# Altium schematic sheet motorServoDriver.SchDoc
size A1; PageSetup: Record=PageOptions|CenterHorizontal=True|CenterVertical=True|PrintScale=1.00|XCorrection=1.00|YCorrection=1.00|PrintKind=1|BorderSize=5000000|LeftOffset=0|BottomOffset=0|Orientation=2|PaperLength=1000|PaperWidth=1000|Scale=100|PaperSource=7|PrintQuality=-3|MediaType=1|DitherType=10|PrintScaleMode=1|PaperKind=A3|PaperIndex=8
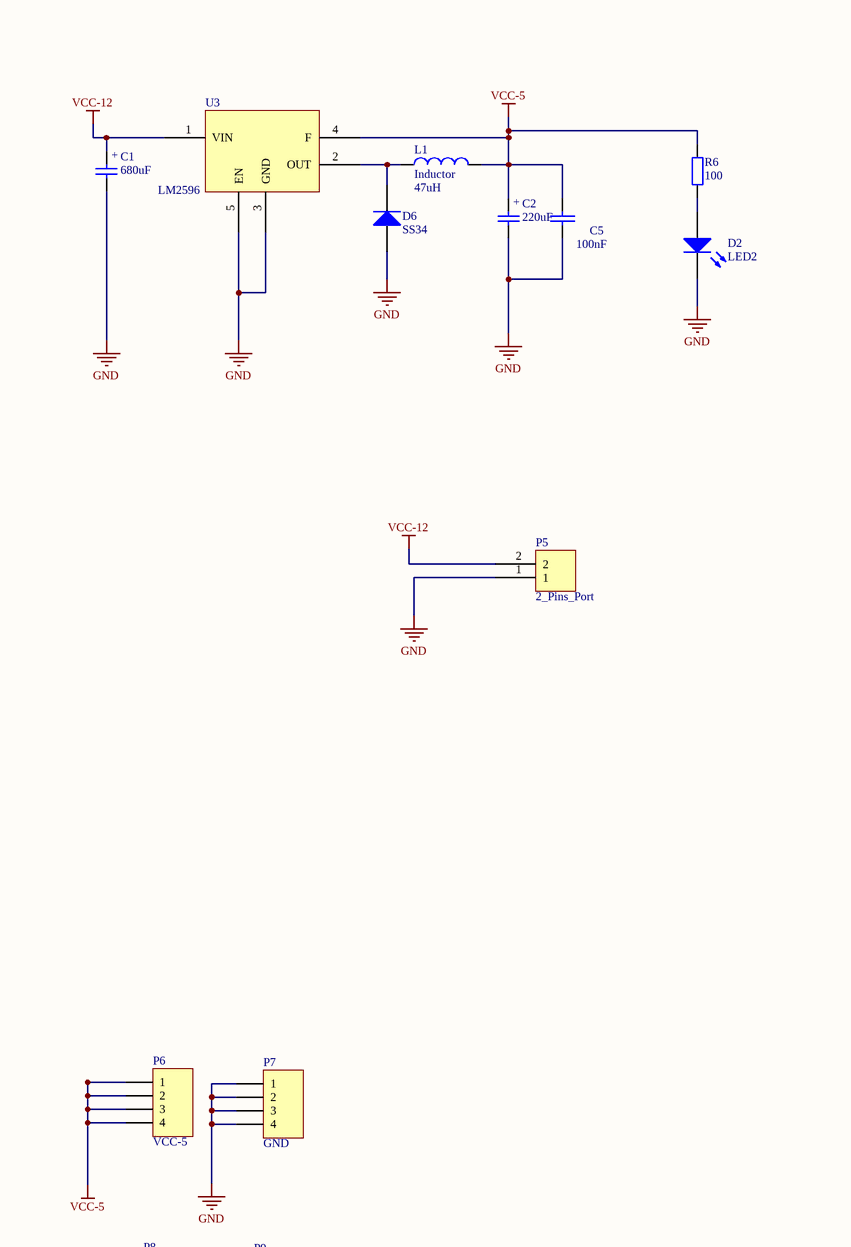
[diagram p0: motorServoDriver.SchDoc, top left]
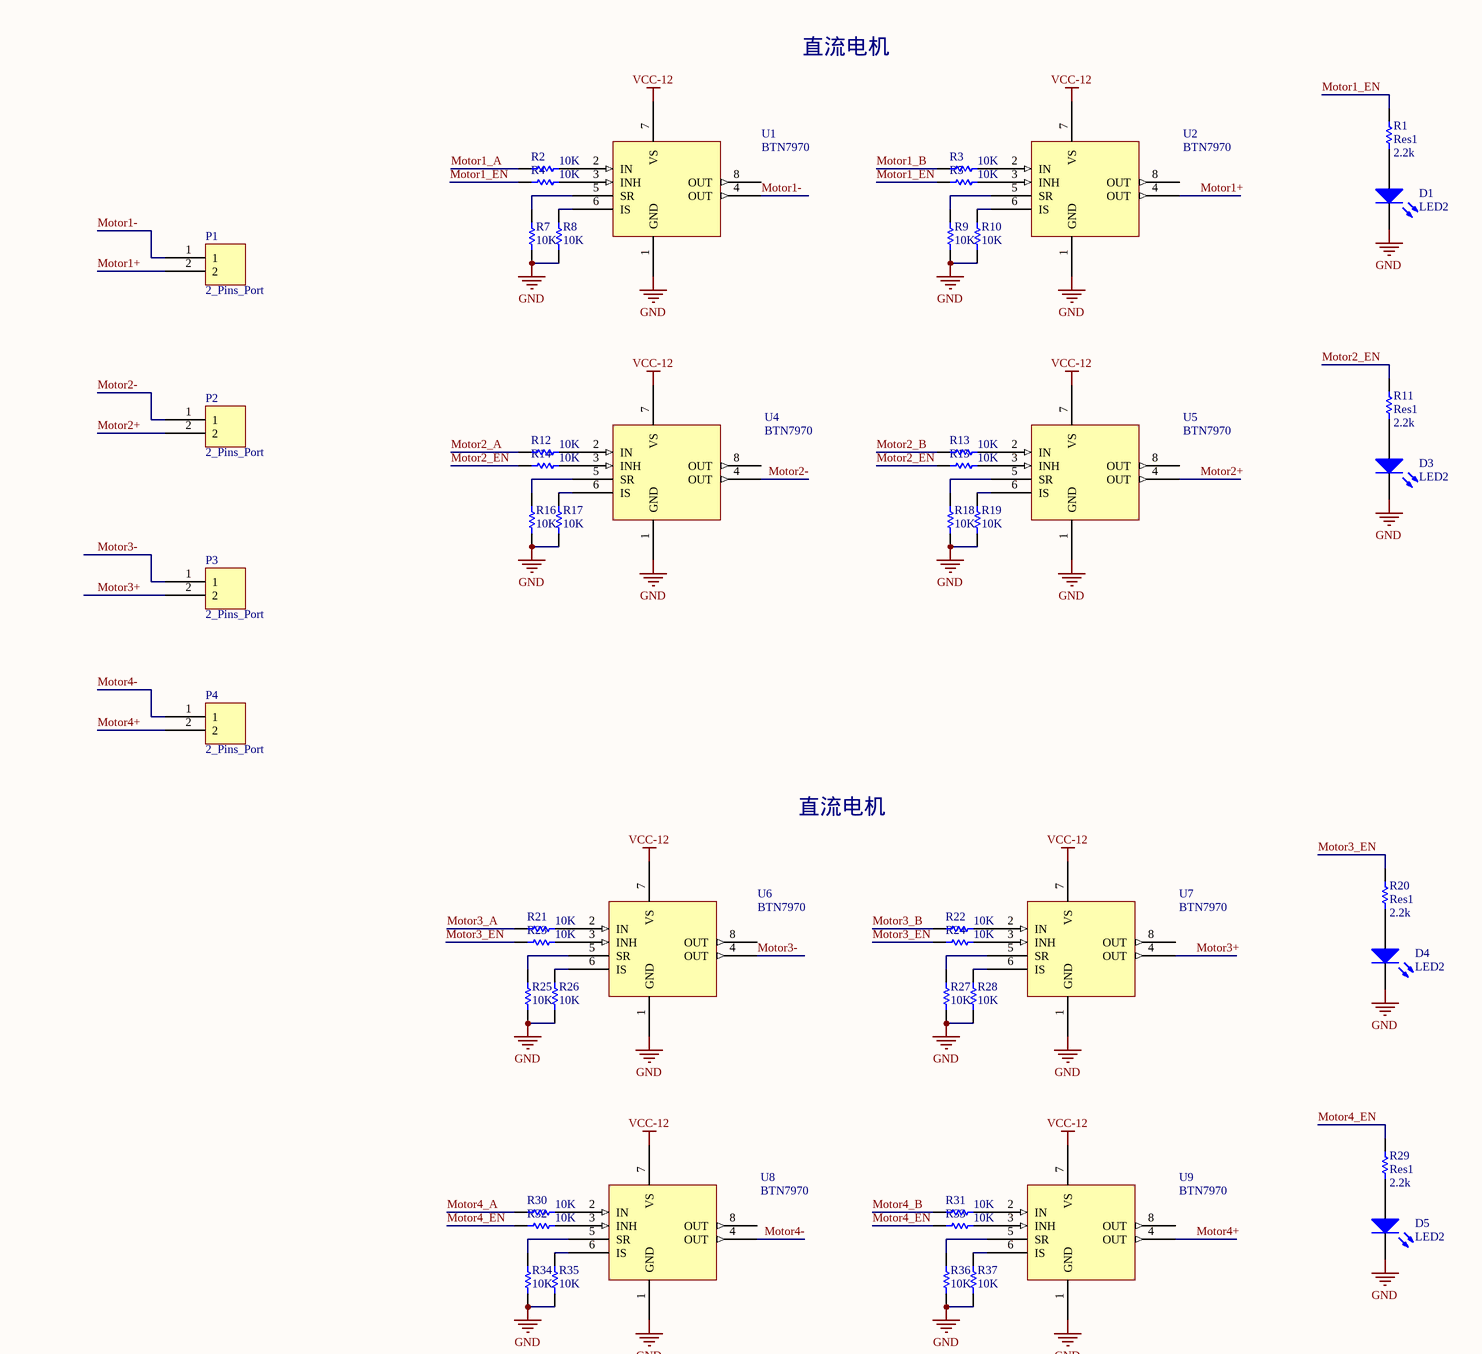
[diagram p1: motorServoDriver.SchDoc, top right]
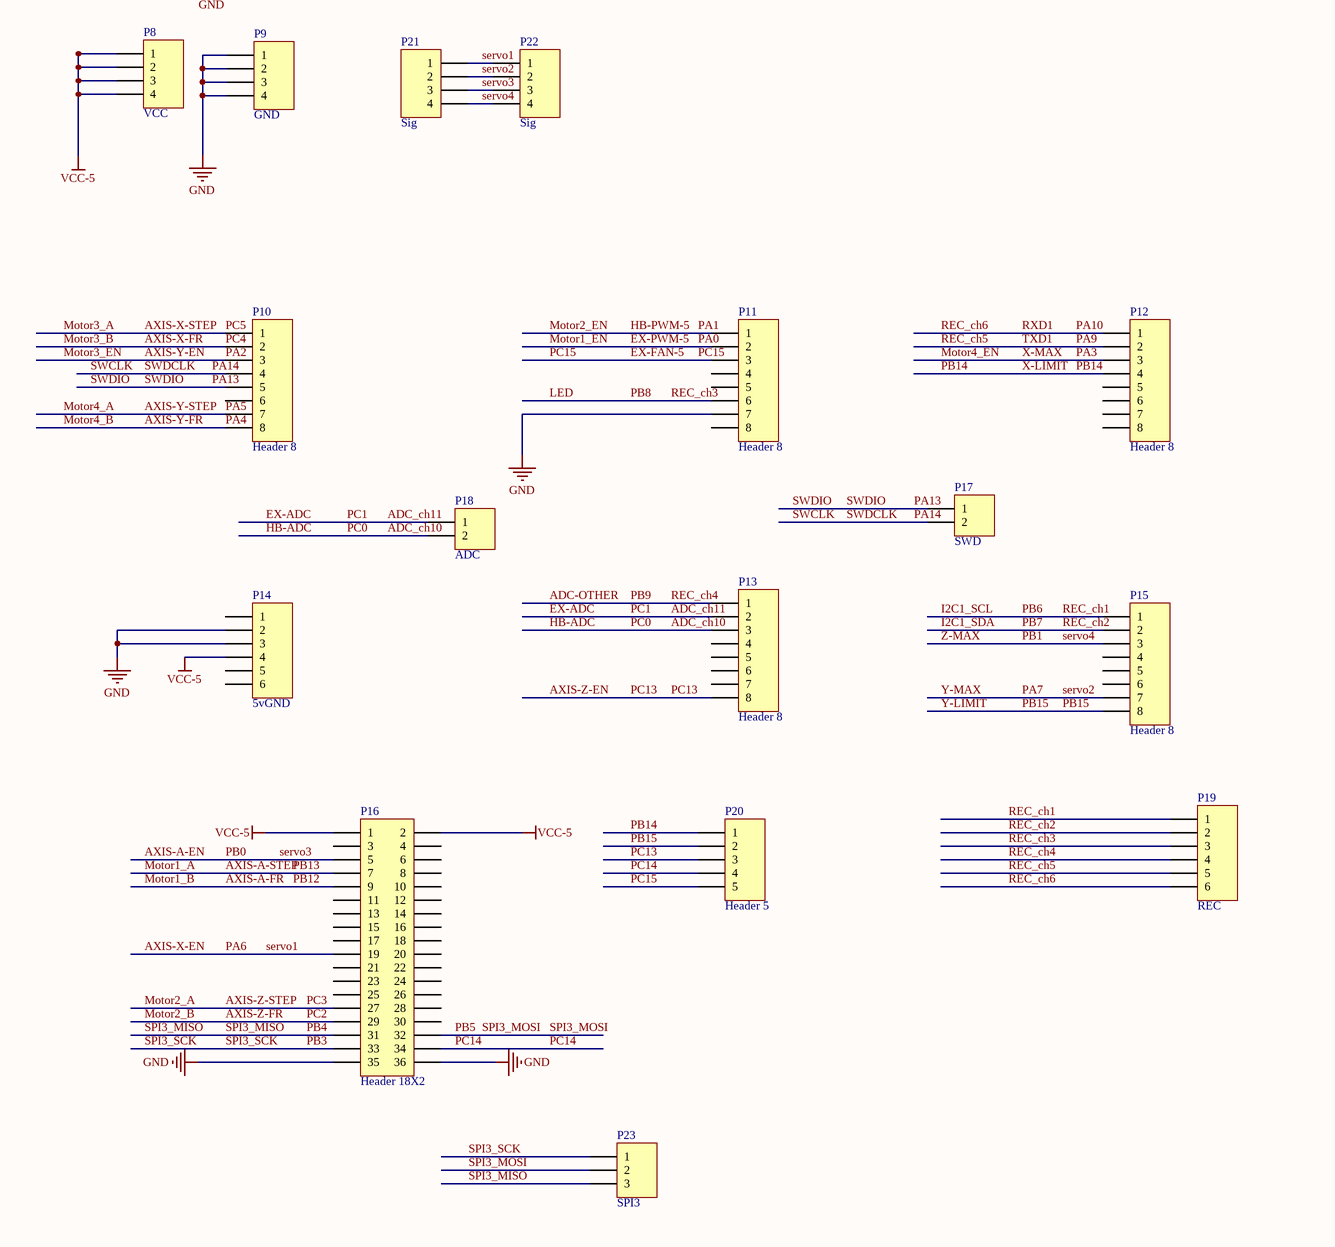
[diagram p2: motorServoDriver.SchDoc, bottom left]

## Parts
C1  value 680uF  [CAP-7343]  (hidden comment: Cap)
C2  value 220uF  [CAP-7343]  (hidden comment: Cap)
C5  value 100nF  [CAP-0603]  (hidden comment: cap smd)
D1  LED2  [D2012[0805]]
D2  LED2  [D2012[0805]]
D3  LED2  [D2012[0805]]
D4  LED2  [D2012[0805]]
D5  LED2  [D2012[0805]]
D6  SS34  [LC-SMB(DO-214AA)_S3]
L1  Inductor  value 47uH  [Inductor1207]
P1  2_Pins_Port  [WJ2EDGV-5.08-2P]
P2  2_Pins_Port  [WJ2EDGV-5.08-2P]
P3  2_Pins_Port  [WJ2EDGV-5.08-2P]
P4  2_Pins_Port  [WJ2EDGV-5.08-2P]
P5  2_Pins_Port  [WJ2EDGV-5.08-2P]
P6  VCC-5  [HDR1X4]
P7  GND  [HDR1X4]
P8  VCC  [HDR1X4]
P9  GND  [HDR1X4]
P10  Header 8  [HDR1X8]
P11  Header 8  [HDR1X8]
P12  Header 8  [HDR1X8]
P13  Header 8  [HDR1X8]
P14  5vGND  [HDR1x6]
P15  Header 8  [HDR1X8]
P16  Header 18X2  [HDR2X18]
P17  SWD  [HDR1X2]
P18  ADC  [HDR1X2]
P19  REC  [HDR1X6]
P20  Header 5  [HDR1X5]
P21  Sig  [HDR1X4]
P22  Sig  [HDR1X4]
P23  SPI3  [HDR1X3]
R1  Res1  value 2.2k  [RES-0603]
R2  10K  [RES-0603]
R3  10K  [RES-0603]
R4  10K  [RES-0603]
R5  10K  [RES-0603]
R6  value 100  [RES-0603]  (hidden comment: RES1)
R7  10K  [RES-0603]
R8  10K  [RES-0603]
R9  10K  [RES-0603]
R10  10K  [RES-0603]
R11  Res1  value 2.2k  [RES-0603]
R12  10K  [RES-0603]
R13  10K  [RES-0603]
R14  10K  [RES-0603]
R15  10K  [RES-0603]
R16  10K  [RES-0603]
R17  10K  [RES-0603]
R18  10K  [RES-0603]
R19  10K  [RES-0603]
R20  Res1  value 2.2k  [RES-0603]
R21  10K  [RES-0603]
R22  10K  [RES-0603]
R23  10K  [RES-0603]
R24  10K  [RES-0603]
R25  10K  [RES-0603]
R26  10K  [RES-0603]
R27  10K  [RES-0603]
R28  10K  [RES-0603]
R29  Res1  value 2.2k  [RES-0603]
R30  10K  [RES-0603]
R31  10K  [RES-0603]
R32  10K  [RES-0603]
R33  10K  [RES-0603]
R34  10K  [RES-0603]
R35  10K  [RES-0603]
R36  10K  [RES-0603]
R37  10K  [RES-0603]
U1  BTN7970  [BTN7970]
U2  BTN7970  [BTN7970]
U3  LM2596  [LC-TO-263-5]
U4  BTN7970  [BTN7970]
U5  BTN7970  [BTN7970]
U6  BTN7970  [BTN7970]
U7  BTN7970  [BTN7970]
U8  BTN7970  [BTN7970]
U9  BTN7970  [BTN7970]

## Nets
GND: C1.2(-) C2.2(-) C5.2 D1.2(K) D2.2(K) D3.2(K) D4.2(K) D5.2(K) D6.1(A) P5.1 P7.1 P7.2 P7.3 P7.4 P9.1 P9.2 P9.3 P9.4 P11.7 P14.2 P14.3 P16.35 P16.36 R7.1 R8.1 R9.1 R10.1 R16.1 R17.1 R18.1 R19.1 R25.1 R26.1 R27.1 R28.1 R34.1 R35.1 R36.1 R37.1 U1.1(GND) U2.1(GND) U3.3(GND) U3.5(EN) U4.1(GND) U5.1(GND) U6.1(GND) U7.1(GND) U8.1(GND) U9.1(GND)
VCC-5: C2.1(+) C5.1 L1.2 P6.1 P6.2 P6.3 P6.4 P8.1 P8.2 P8.3 P8.4 P14.4 P16.1 P16.2 R6.2 U3.4(F)
VCC-12: C1.1(+) P5.2 U1.7(VS) U2.7(VS) U3.1(VIN) U4.7(VS) U5.7(VS) U6.7(VS) U7.7(VS) U8.7(VS) U9.7(VS)
ADC-OTHER: P13.1 P19.4  [also labelled PB9, REC_ch4]
ADC_ch10: P13.3 P18.2  [also labelled HB-ADC, PC0]
ADC_ch11: P13.2 P18.1  [also labelled EX-ADC, PC1]
AXIS-A-EN: P16.5 P21.3 P22.3  [also labelled PB0, servo3]
AXIS-A-FR: P16.9 R3.1  [also labelled Motor1_B, PB12]
AXIS-A-STEP: P16.7 R2.1  [also labelled Motor1_A, PB13]
AXIS-X-EN: P16.19 P21.1 P22.1  [also labelled PA6, servo1]
AXIS-X-FR: P10.2 R22.1  [also labelled Motor3_B, PC4]
AXIS-X-STEP: P10.1 R21.1  [also labelled Motor3_A, PC5]
AXIS-Y-EN: P10.3 R20.2 R23.1 R24.1  [also labelled Motor3_EN, PA2]
AXIS-Y-FR: P10.8 R31.1  [also labelled Motor4_B, PA4]
AXIS-Y-STEP: P10.7 R30.1  [also labelled Motor4_A, PA5]
AXIS-Z-EN: P13.8 P20.3  [also labelled PC13]
AXIS-Z-FR: P16.29 R13.1  [also labelled Motor2_B, PC2]
AXIS-Z-STEP: P16.27 R12.1  [also labelled Motor2_A, PC3]
EX-FAN-5: P11.3 P20.5  [also labelled PC15]
EX-PWM-5: P11.2 R1.2 R4.1 R5.1  [also labelled Motor1_EN, PA0]
HB-PWM-5: P11.1 R11.2 R14.1 R15.1  [also labelled Motor2_EN, PA1]
I2C1_SCL: P15.1 P19.1  [also labelled PB6, REC_ch1]
I2C1_SDA: P15.2 P19.2  [also labelled PB7, REC_ch2]
LED: P11.6 P19.3  [also labelled PB8, REC_ch3]
Motor1+: P1.2 U2.4(OUT)
Motor1-: P1.1 U1.4(OUT)
Motor2+: P2.2 U5.4(OUT)
Motor2-: P2.1 U4.4(OUT)
Motor3+: P3.2 U7.4(OUT)
Motor3-: P3.1 U6.4(OUT)
Motor4+: P4.2 U9.4(OUT)
Motor4-: P4.1 U8.4(OUT)
Motor4_EN: P12.3 R29.2 R32.1 R33.1  [also labelled PA3, X-MAX]
PA7: P15.7 P21.2 P22.2  [also labelled servo2, Y-MAX]
PA9: P12.2 P19.5  [also labelled REC_ch5, TXD1]
PA10: P12.1 P19.6  [also labelled REC_ch6, RXD1]
PA13: P10.5 P17.1  [also labelled SWDIO]
PA14: P10.4 P17.2  [also labelled SWCLK, SWDCLK]
PB1: P15.3 P21.4 P22.4  [also labelled servo4, Z-MAX]
PB3: P16.33 P23.1  [also labelled SPI3_SCK]
PB4: P16.31 P23.3  [also labelled SPI3_MISO]
PB5: P16.32 P23.2  [also labelled SPI3_MOSI]
PB14: P12.4 P20.1  [also labelled X-LIMIT]
PB15: P15.8 P20.2  [also labelled Y-LIMIT]
PC14: P16.34 P20.4
NetD1_1: D1.1(A) R1.1
NetD2_1: D2.1(A) R6.1
NetD3_1: D3.1(A) R11.1
NetD4_1: D4.1(A) R20.1
NetD5_1: D5.1(A) R29.1
NetD6_2: D6.2(K) L1.1 U3.2(OUT)
NetR2_2: R2.2 U1.2(IN)
NetR3_2: R3.2 U2.2(IN)
NetR4_2: R4.2 U1.3(INH)
NetR5_2: R5.2 U2.3(INH)
NetR7_2: R7.2 U1.5(SR)
NetR8_2: R8.2 U1.6(IS)
NetR9_2: R9.2 U2.5(SR)
NetR10_2: R10.2 U2.6(IS)
NetR12_2: R12.2 U4.2(IN)
NetR13_2: R13.2 U5.2(IN)
NetR14_2: R14.2 U4.3(INH)
NetR15_2: R15.2 U5.3(INH)
NetR16_2: R16.2 U4.5(SR)
NetR17_2: R17.2 U4.6(IS)
NetR18_2: R18.2 U5.5(SR)
NetR19_2: R19.2 U5.6(IS)
NetR21_2: R21.2 U6.2(IN)
NetR22_2: R22.2 U7.2(IN)
NetR23_2: R23.2 U6.3(INH)
NetR24_2: R24.2 U7.3(INH)
NetR25_2: R25.2 U6.5(SR)
NetR26_2: R26.2 U6.6(IS)
NetR27_2: R27.2 U7.5(SR)
NetR28_2: R28.2 U7.6(IS)
NetR30_2: R30.2 U8.2(IN)
NetR31_2: R31.2 U9.2(IN)
NetR32_2: R32.2 U8.3(INH)
NetR33_2: R33.2 U9.3(INH)
NetR34_2: R34.2 U8.5(SR)
NetR35_2: R35.2 U8.6(IS)
NetR36_2: R36.2 U9.5(SR)
NetR37_2: R37.2 U9.6(IS)

Not connected (* = marked no-connect by the designer): P10 6; P11 4 5 8; P12 5 6 7 8; P13 4 5 6 7; P14 1 5 6; P15 4 5 6; P16 3 4 6 8 10 11 12 13 14 15 16 17 18 20 21 22 23 24 25 26 28 30; U1 8(OUT); U2 8(OUT); U4 8(OUT); U5 8(OUT); U6 8(OUT); U7 8(OUT); U8 8(OUT); U9 8(OUT)

## Notes on the sheet
- 直流电机

## Library data of the parts
C1 C2 = Cap Pol S: 贴片极性电容
C5 = CAP: 贴片无极性电容
D1-D5 = LED2: Typical RED, GREEN, YELLOW, AMBER GaAs LED; Published: 8-Jun-2000; LatestRevisionDate: 17-Jul-2002; LatestRevisionNote: Re-released for DXP Platform.; PackageReference: 3.2X1.6X1.1; Publisher: Altium Limited
  D1 D3-D5: PackageVersion: Feb-2002; PackageDescription: SM LED; 2 Flat Leads
  D2: PackageDocument: Feb-2002
D6 = Diode 1N5400: 3 Amp General Purpose Rectifier; Published: 8-Jun-2000; LatestRevisionDate: 17-Jul-2002; LatestRevisionNote: Re-released for DXP Platform.; DatasheetVersion: 1998; PackageVersion: Aug-1999; PackageReference: DO-201AD; Publisher: Altium Limited; PackageDescription: Diode, Axial; Body 9.5 x 5.6 mm (LxDia. max), Lead Dia. 1.32 mm (max); ComponentLink1Description: Manufacturer Link; ComponentLink1URL: http://www.fairchildsemi.com/; ComponentLink2Description: Datasheet; ComponentLink2URL: http://www.fairchildsemi.com/ds/1N%2F1N5400.pdf
L1 = Inductor: Code_IEC: 1005; Published: 8-Jun-2000; LatestRevisionDate: 29-May-2009; LatestRevisionNote: IPC-7351 Footprint Added.; PackageReference: 0402-A; Publisher: Altium Limited; PackageDescription: Chip Inductor; Code_JEITA: 0402
P6-P9 P21 P22 = Header 4: Header, 4-Pin; LatestRevisionDate: 17-Jul-2002; LatestRevisionNote: Re-released for DXP Platform.; Publisher: Altium Limited
P10-P13 P15 = Header 8: Header, 8-Pin; LatestRevisionDate: 17-Jul-2002; LatestRevisionNote: Re-released for DXP Platform.; Publisher: Altium Limited
P14 P19 = Header 6: Header, 6-Pin; LatestRevisionDate: 17-Jul-2002; LatestRevisionNote: Re-released for DXP Platform.; Publisher: Altium Limited
P16 = Header 18X2: Header, 18-Pin, Dual row; LatestRevisionDate: 17-Jul-2002; LatestRevisionNote: Re-released for DXP Platform.; Publisher: Altium Limited
P17 P18 = Header 2: Header, 2-Pin; LatestRevisionDate: 17-Jul-2002; LatestRevisionNote: Re-released for DXP Platform.; Publisher: Altium Limited
P20 = Header 5: Header, 5-Pin; LatestRevisionDate: 17-Jul-2002; LatestRevisionNote: Re-released for DXP Platform.; Publisher: Altium Limited
P23 = Header 3: Header, 3-Pin; LatestRevisionDate: 17-Jul-2002; LatestRevisionNote: Re-released for DXP Platform.; Publisher: Altium Limited
R1 R11 R20 R29 = Res1: Resistor; Published: 8-Jun-2000; LatestRevisionDate: 17-Jul-2002; LatestRevisionNote: Re-released for DXP Platform.; PackageReference: AXIAL-0.3; Publisher: Altium Limited; PackageDescription: Axial Device, Thru-Hole; 2 Leads; 0.3 in Pin Spacing
R2-R5 R7-R10 R12-R19 R21-R28 R30-R37 = res1: Resistor; Revision: July-2002: Re-released for DXP Platform.; Value: 10K
U1 U2 U4-U9 = BTN7970: pin to pad: 8>4